# EAGLE schematic ControleM (EAGLE 7.1.0)
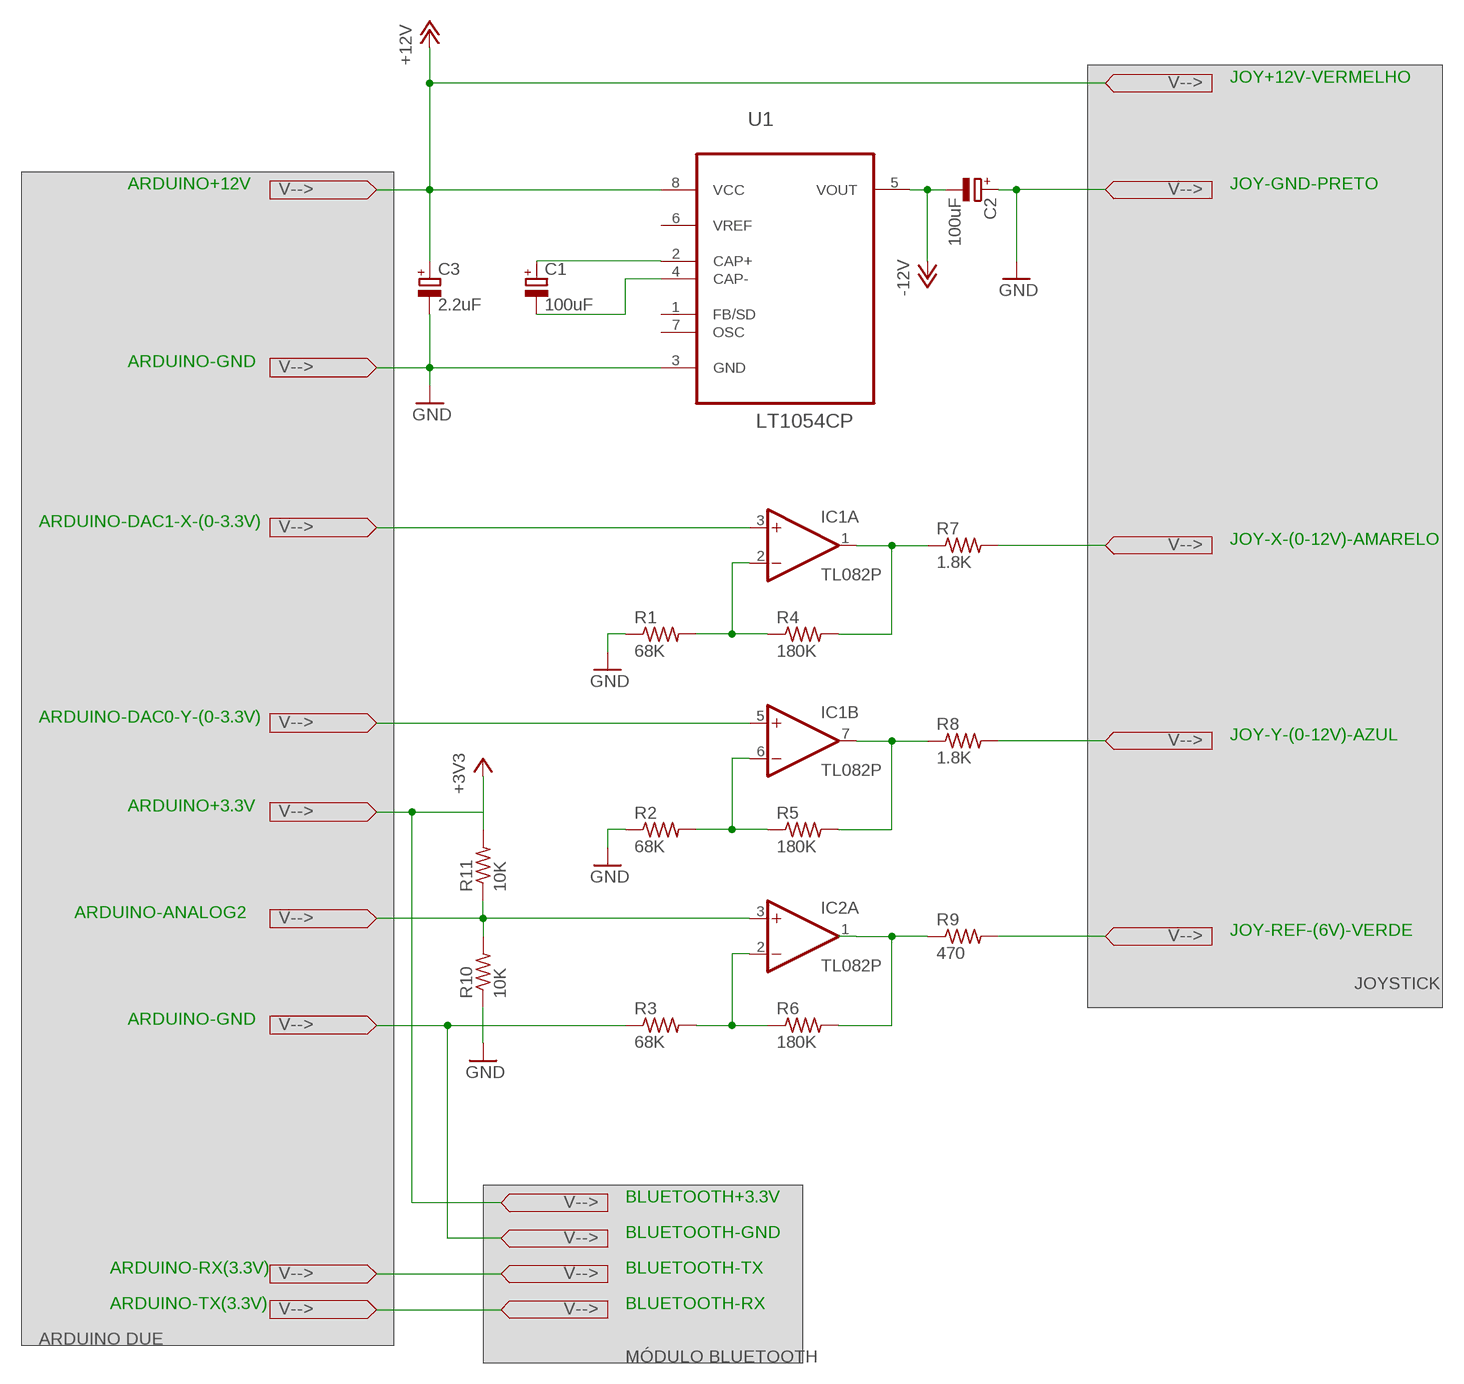
[diagram p0: schematic, sheet 1]

## Parts
C1  100uF  CPOL-EUE2.5-6  [E2,5-6]
C2  100uF  CPOL-EUE2.5-6  [E2,5-6]
C3  2.2uF  CPOL-EUE2.5-6  [E2,5-6]
IC1  TL082P  [DIL08]
IC2  TL082P  [DIL08]
R1  68K  R-US_0207/12  [0207/12]
R2  68K  R-US_0207/12  [0207/12]
R3  68K  R-US_0207/12  [0207/12]
R4  180K  R-US_0207/12  [0207/12]
R5  180K  R-US_0207/12  [0207/12]
R6  180K  R-US_0207/12  [0207/12]
R7  1.8K  R-US_0207/12  [0207/12]
R8  1.8K  R-US_0207/12  [0207/12]
R9  470  R-US_0207/12  [0207/12]
R10  10K  R-US_0207/12  [0207/12]
R11  10K  R-US_0207/12  [0207/12]
U1  LT1054CP  [DIP254P762X508-8]

## Nets
+3V3: R11.2
+12V: C3.+ U1.8(VCC)
-12V: C2.- U1.5(VOUT)
GND: C2.+ C3.- R1.1 R2.1 R3.1 R10.1 U1.3(GND)
N$1: C1.+ U1.2(CAP+)
N$2: C1.- U1.4(CAP-)
N$3: IC1.2(A:-IN) R1.2 R4.1
N$4: IC1.6(B:-IN) R2.2 R5.1
N$5: IC1.3(A:+IN)
N$6: IC1.5(B:+IN)
N$7: IC2.1(A:OUT) R6.2 R9.1
N$8: IC1.1(A:OUT) R4.2 R7.1
N$9: IC1.7(B:OUT) R5.2 R8.1
N$10: IC2.3(A:+IN) R10.2 R11.1
N$11: IC2.2(A:-IN) R3.2 R6.1
N$12: R7.2
N$13: R8.2
N$14: R9.2
Unconnected: IC2.5(B:+IN) IC2.6(B:-IN) IC2.7(B:OUT) U1.1(FB/SD) U1.6(VREF) U1.7(OSC)

## Notes on the sheet
- JOY+12V-VERMELHO
- ARDUINO+12V | JOY-GND-PRETO
- ARDUINO-GND
- ARDUINO-DAC1-X-(0-3.3V)
- JOY-X-(0-12V)-AMARELO
- ARDUINO-DAC0-Y-(0-3.3V)
- JOY-Y-(0-12V)-AZUL
- ARDUINO+3.3V
- ARDUINO-ANALOG2
- JOY-REF-(6V)-VERDE
- JOYSTICK
- ARDUINO-GND
- BLUETOOTH+3.3V
- BLUETOOTH-GND
- ARDUINO-RX(3.3V) | BLUETOOTH-TX
- ARDUINO-TX(3.3V) | BLUETOOTH-RX
- ARDUINO DUE
- MÓDULO BLUETOOTH

## Power pins joined to a net without a drawn wire
V+: IC1.8(P:V+) IC2.8(P:V+)
V-: IC1.4(P:V-) IC2.4(P:V-)

## Library data of the parts
C1-C3 = rcl:CPOL-EU: POLARIZED CAPACITOR, European symbol
IC1 IC2 = linear:TL082: OP AMP Data sheet <http://www.ti.com/lit/ds/symlink/tl084a . pdf>; DATA_SHEET: <a href="http://www.ti.com/lit/ds/symlink/tl084a.pdf"> Data sheet </a>
R1-R11 = resistor:R-US_: RESISTOR, American symbol
U1 = texas_element14:LT1054CP: VOLTAGE CONVERTERS WITH REGULATORS; MPN: LT1054CP; OC_FARNELL: 1648667; OC_NEWARK: 60K6196; PACKAGE: PDIP-8; SUPPLIER: Texas Instruments